# EAGLE schematic improved serial interface (EAGLE 8.1.0)
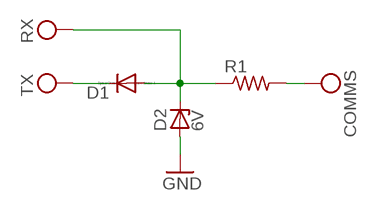
[diagram p0: schematic, sheet 1]

## Parts
D1  1N4148DO35-10  [DO35-10]
D2  6V  BZV10  [DO34Z7]
R1  R-US_0207/10  [0207/10]

## Nets
GND: D2.A
VCC: D1.A D1.C D2.C R1.1 R1.2 ; supply symbol labelled TX, RX, COMMS

## Library data of the parts
D1 = diode:1N4148: DIODE high speed (Philips)
D2 = diode:BZV10: Z DIODE
R1 = rcl:R-US_: RESISTOR, American symbol